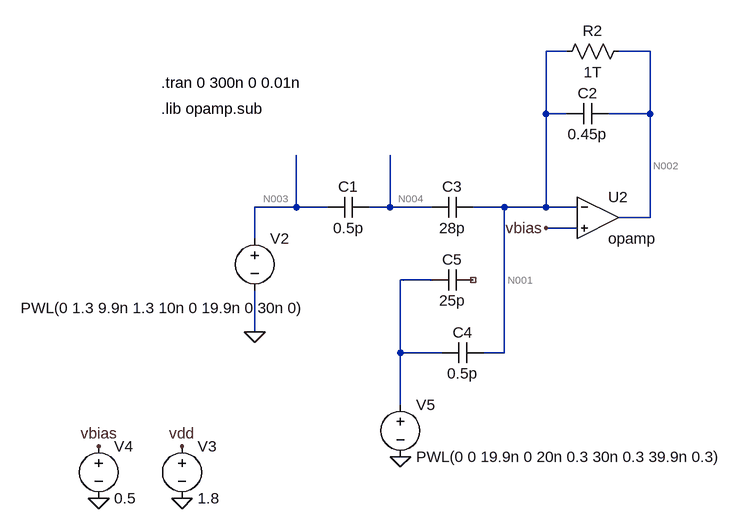
[diagram p0: schematic injecciondecarga_mas_pc.asc]
injecciondecarga_mas_pc.asc, the LTspice schematic file:
Version 4
SHEET 1 880 680
WIRE -400 -272 -432 -272
WIRE -272 -272 -320 -272
WIRE -432 -176 -432 -272
WIRE -400 -176 -432 -176
WIRE -272 -176 -272 -272
WIRE -272 -176 -336 -176
WIRE -816 -32 -816 -112
WIRE -816 -32 -880 -32
WIRE -768 -32 -816 -32
WIRE -672 -32 -672 -112
WIRE -672 -32 -704 -32
WIRE -608 -32 -672 -32
WIRE -496 -32 -544 -32
WIRE -432 -32 -432 -176
WIRE -432 -32 -496 -32
WIRE -384 -32 -432 -32
WIRE -272 -16 -272 -176
WIRE -272 -16 -320 -16
WIRE -384 0 -432 0
WIRE -880 16 -880 -32
WIRE -608 80 -656 80
WIRE -880 160 -880 96
WIRE -656 192 -656 80
WIRE -592 192 -656 192
WIRE -496 192 -496 -32
WIRE -496 192 -528 192
WIRE -656 272 -656 192
FLAG -880 160 0
FLAG -992 416 0
FLAG -992 336 vdd
FLAG -1120 416 0
FLAG -1120 336 vbias
FLAG -432 0 vbias
FLAG -656 352 0
SYMBOL cap -336 -192 R90
WINDOW 0 0 32 VBottom 2
WINDOW 3 32 32 VTop 2
SYMATTR InstName C2
SYMATTR Value 0.45p
SYMBOL cap -544 -48 R90
WINDOW 0 0 32 VBottom 2
WINDOW 3 32 32 VTop 2
SYMATTR InstName C3
SYMATTR Value 28p
SYMBOL voltage -880 0 R0
WINDOW 123 0 0 Left 2
WINDOW 39 0 0 Left 2
WINDOW 3 -360 123 Left 2
SYMATTR Value PWL(0 1.3 9.9n 1.3 10n 0 19.9n 0 30n 0)
SYMATTR InstName V2
SYMBOL voltage -992 320 R0
WINDOW 123 0 0 Left 2
WINDOW 39 0 0 Left 2
SYMATTR InstName V3
SYMATTR Value 1.8
SYMBOL res -304 -288 R90
WINDOW 0 0 56 VBottom 2
WINDOW 3 32 56 VTop 2
SYMATTR InstName R2
SYMATTR Value 1T
SYMBOL voltage -1120 320 R0
WINDOW 123 0 0 Left 2
WINDOW 39 0 0 Left 2
SYMATTR InstName V4
SYMATTR Value 0.5
SYMBOL voltage -656 256 R0
WINDOW 123 0 0 Left 2
WINDOW 39 0 0 Left 2
SYMATTR InstName V5
SYMATTR Value PWL(0 0 19.9n 0 20n 0.3 30n 0.3 39.9n 0.3)
SYMBOL cap -528 176 R90
WINDOW 0 0 32 VBottom 2
WINDOW 3 32 32 VTop 2
SYMATTR InstName C4
SYMATTR Value 0.5p
SYMBOL Opamps\\opamp -352 -80 R0
SYMATTR InstName U2
SYMBOL cap -704 -48 R90
WINDOW 0 0 32 VBottom 2
WINDOW 3 32 32 VTop 2
SYMATTR InstName C1
SYMATTR Value 0.5p
SYMBOL cap -544 64 R90
WINDOW 0 0 32 VBottom 2
WINDOW 3 32 32 VTop 2
SYMATTR InstName C5
SYMATTR Value 25p
TEXT -1024 -224 Left 2 !.tran 0 300n 0 0.01n
TEXT -1024 -184 Left 2 !.lib opamp.sub

The netlist it stands for:
* injecciondecarga_mas_pc.asc
C2 N002 N001 0.45p
C3 N001 N004 28p
V2 N003 0 PWL(0 1.3 9.9n 1.3 10n 0 19.9n 0 30n 0)
V3 vdd 0 1.8
R2 N002 N001 1T
V4 vbias 0 0.5
V5 N005 0 PWL(0 0 19.9n 0 20n 0.3 30n 0.3 39.9n 0.3)
C4 N001 N005 0.5p
XU2 N001 vbias N002 opamp Aol=100K GBW=10Meg  ; pins invin noninvin out
C1 N004 N003 0.5p
C5 NC_01 N005 25p
.tran 0 300n 0 0.01n
.lib opamp.sub
.backanno
.end

* Results of the author's LTspice run, read from the files saved beside the schematic
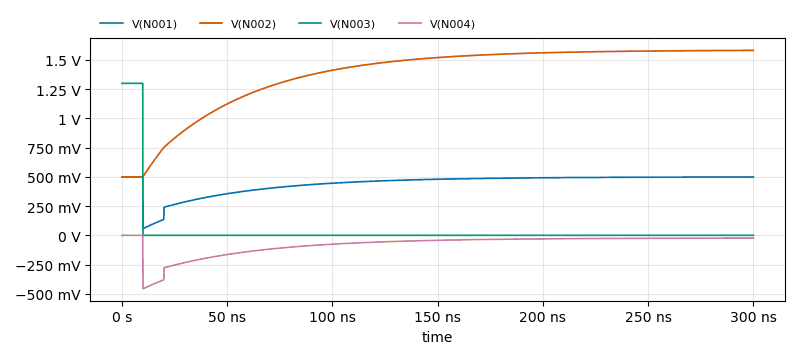
[diagram p1: Transient Analysis of injecciondecarga_mas_pc.asc, plotted from the saved traces]
* Transient Analysis, 1 run:
*   V(N001): min 57.34 mV, max 500 mV, average 442.6 mV, rms 451.4 mV, last 498.9 mV
*   V(N002): min 500 mV, max 1.582 V, average 1.377 V, rms 1.407 V, last 1.582 V
*   V(N003): min 0 V, max 1.3 V, average 43.12 mV, rms 236.8 mV, last 0 V
*   V(N004): min -457.7 mV, max 0 V, average -78.47 mV, rms 117.7 mV, last -23.87 mV